# Altium schematic sheet Dongle.SchDoc
size A
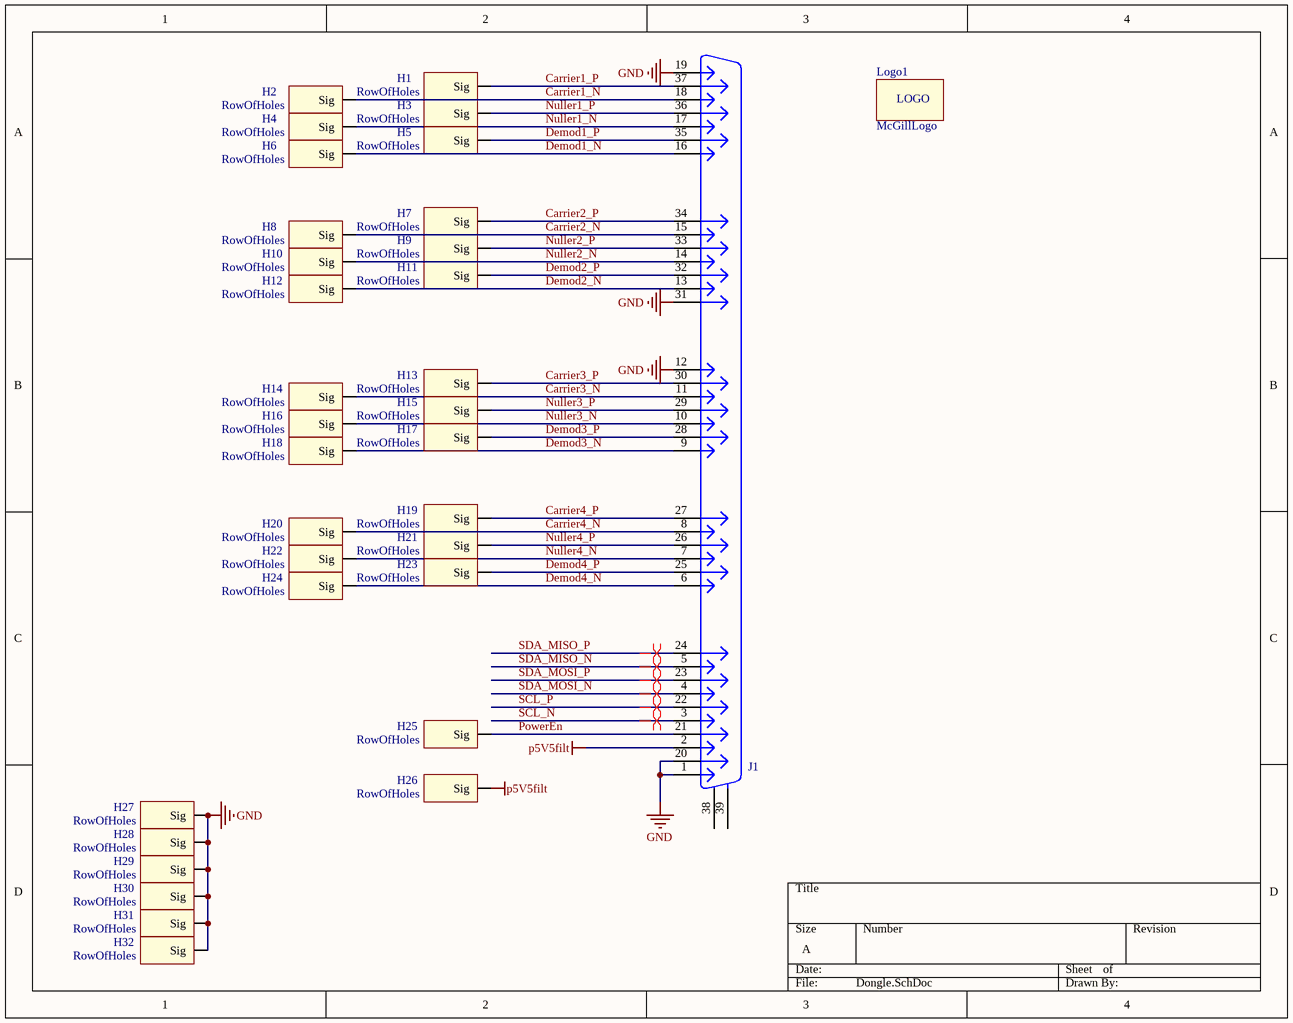
[diagram p0: Dongle.SchDoc]

## Parts
H1  RowOfHoles  [RowOfHoles]  (no BOM)
H2  RowOfHoles  [RowOfHoles]  (no BOM)
H3  RowOfHoles  [RowOfHoles]  (no BOM)
H4  RowOfHoles  [RowOfHoles]  (no BOM)
H5  RowOfHoles  [RowOfHoles]  (no BOM)
H6  RowOfHoles  [RowOfHoles]  (no BOM)
H7  RowOfHoles  [RowOfHoles]  (no BOM)
H8  RowOfHoles  [RowOfHoles]  (no BOM)
H9  RowOfHoles  [RowOfHoles]  (no BOM)
H10  RowOfHoles  [RowOfHoles]  (no BOM)
H11  RowOfHoles  [RowOfHoles]  (no BOM)
H12  RowOfHoles  [RowOfHoles]  (no BOM)
H13  RowOfHoles  [RowOfHoles]  (no BOM)
H14  RowOfHoles  [RowOfHoles]  (no BOM)
H15  RowOfHoles  [RowOfHoles]  (no BOM)
H16  RowOfHoles  [RowOfHoles]  (no BOM)
H17  RowOfHoles  [RowOfHoles]  (no BOM)
H18  RowOfHoles  [RowOfHoles]  (no BOM)
H19  RowOfHoles  [RowOfHoles]  (no BOM)
H20  RowOfHoles  [RowOfHoles]  (no BOM)
H21  RowOfHoles  [RowOfHoles]  (no BOM)
H22  RowOfHoles  [RowOfHoles]  (no BOM)
H23  RowOfHoles  [RowOfHoles]  (no BOM)
H24  RowOfHoles  [RowOfHoles]  (no BOM)
H25  RowOfHoles  [RowOfHoles]  (no BOM)
H26  RowOfHoles  [RowOfHoles]  (no BOM)
H27  RowOfHoles  [RowOfHoles]  (no BOM)
H28  RowOfHoles  [RowOfHoles]  (no BOM)
H29  RowOfHoles  [RowOfHoles]  (no BOM)
H30  RowOfHoles  [RowOfHoles]  (no BOM)
H31  RowOfHoles  [RowOfHoles]  (no BOM)
H32  RowOfHoles  [RowOfHoles]  (no BOM)
J1  DB37M  [DSUB37-M]  (value not drawn)
Logo1  McGillLogo  [McGillLogo1]  (no BOM)

## Nets
GND: H27.0(Sig) H28.0(Sig) H29.0(Sig) H30.0(Sig) H31.0(Sig) H32.0(Sig) J1.1 J1.12 J1.19 J1.20 J1.31
p5V5filt: H26.0(Sig) J1.2
Carrier1_N: H2.0(Sig) J1.18
Carrier1_P: H1.0(Sig) J1.37
Carrier2_N: H8.0(Sig) J1.15
Carrier2_P: H7.0(Sig) J1.34
Carrier3_N: H14.0(Sig) J1.11
Carrier3_P: H13.0(Sig) J1.30
Carrier4_N: H20.0(Sig) J1.8
Carrier4_P: H19.0(Sig) J1.27
Demod1_N: H6.0(Sig) J1.16
Demod1_P: H5.0(Sig) J1.35
Demod2_N: H12.0(Sig) J1.13
Demod2_P: H11.0(Sig) J1.32
Demod3_N: H18.0(Sig) J1.9
Demod3_P: H17.0(Sig) J1.28
Demod4_N: H24.0(Sig) J1.6
Demod4_P: H23.0(Sig) J1.25
Nuller1_N: H4.0(Sig) J1.17
Nuller1_P: H3.0(Sig) J1.36
Nuller2_N: H10.0(Sig) J1.14
Nuller2_P: H9.0(Sig) J1.33
Nuller3_N: H16.0(Sig) J1.10
Nuller3_P: H15.0(Sig) J1.29
Nuller4_N: H22.0(Sig) J1.7
Nuller4_P: H21.0(Sig) J1.26
PowerEn: H25.0(Sig) J1.21
SCL_N: J1.3
SCL_P: J1.22
SDA_MISO_N: J1.5
SDA_MISO_P: J1.24
SDA_MOSI_N: J1.4
SDA_MOSI_P: J1.23

Not connected (* = marked no-connect by the designer): J1 38(MH1) 39(MH2)

## Layout directives
differential pair: SCL_N, SCL_P, SDA_MISO_N, SDA_MISO_P, SDA_MOSI_N, SDA_MOSI_P

## Notes on the sheet
- (in symbol Logo) LOGO

## Library data of the parts
J1 = DB37M: Manufacturer: Norcomp; Part Constraints: 182-037-113R531; Assembly Comments: none; Supplier: Digikey; Supplier Part Number: 182-37ME-ND; Value: DB37M; Manufacturer Part Number: 182-037-113R531; Cost: $4.32; Type: thru-hole
Logo1 = Logo: Silkscreen Logo; Manufacturer: McGill; Assembly Comments: none; Value: McGillLogo; Cost: $0; Type: SMD